# EAGLE schematic untitled (EAGLE 9.1.3)
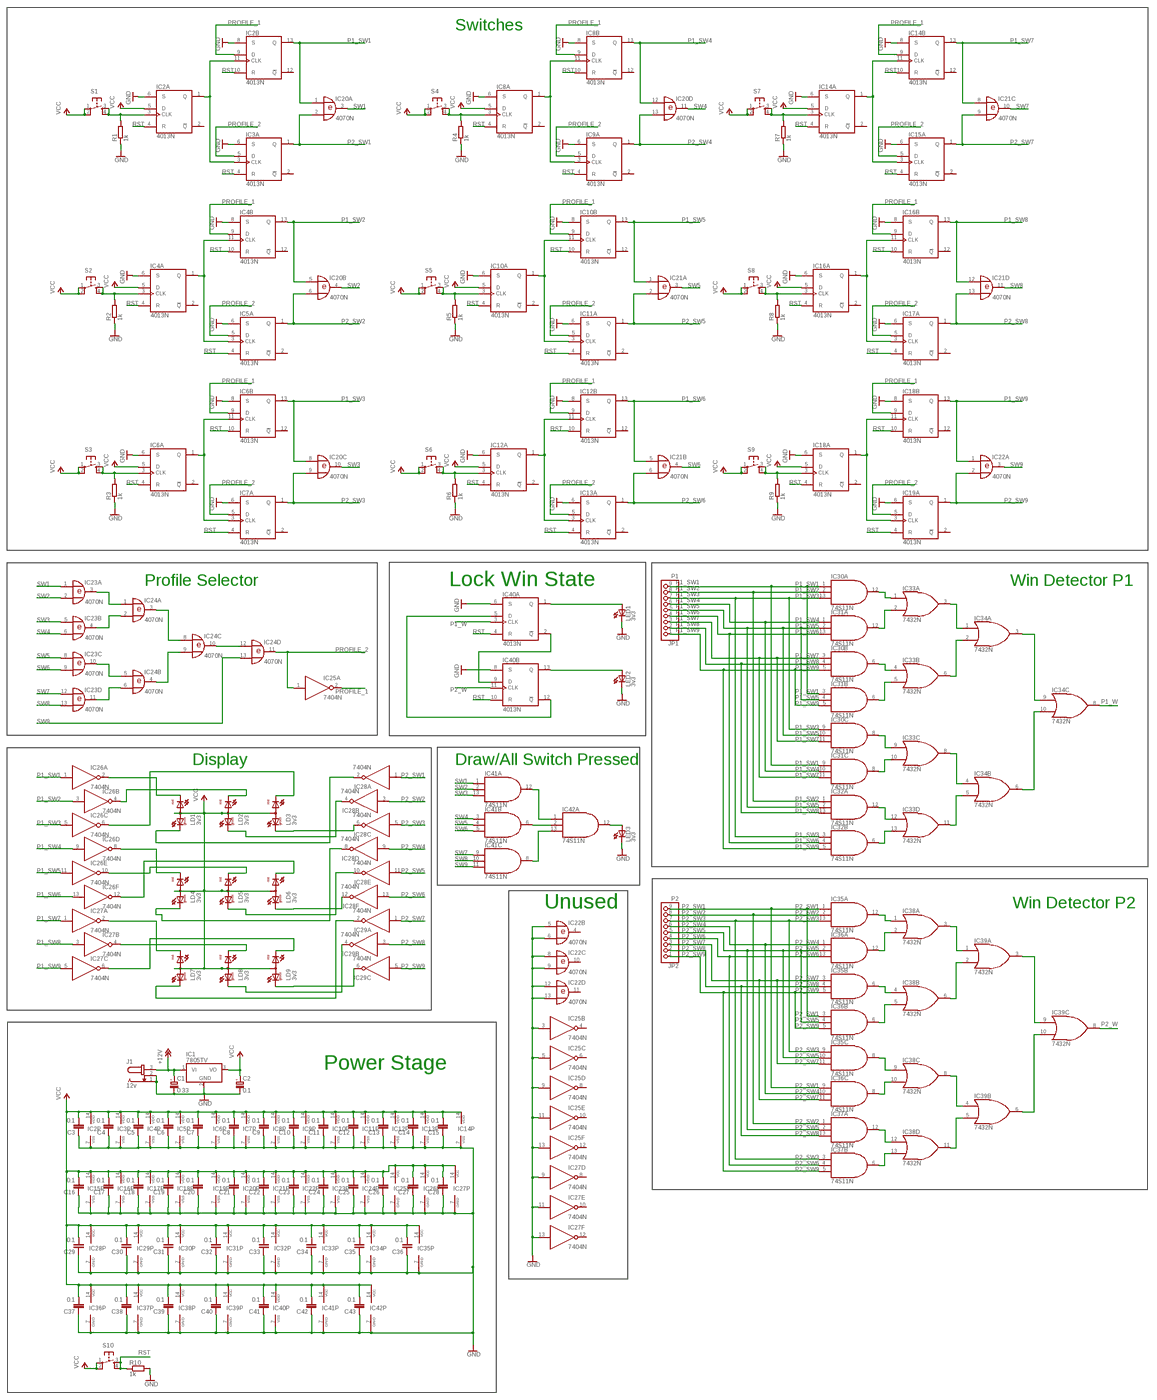
[diagram p0: schematic, sheet 1, overview]
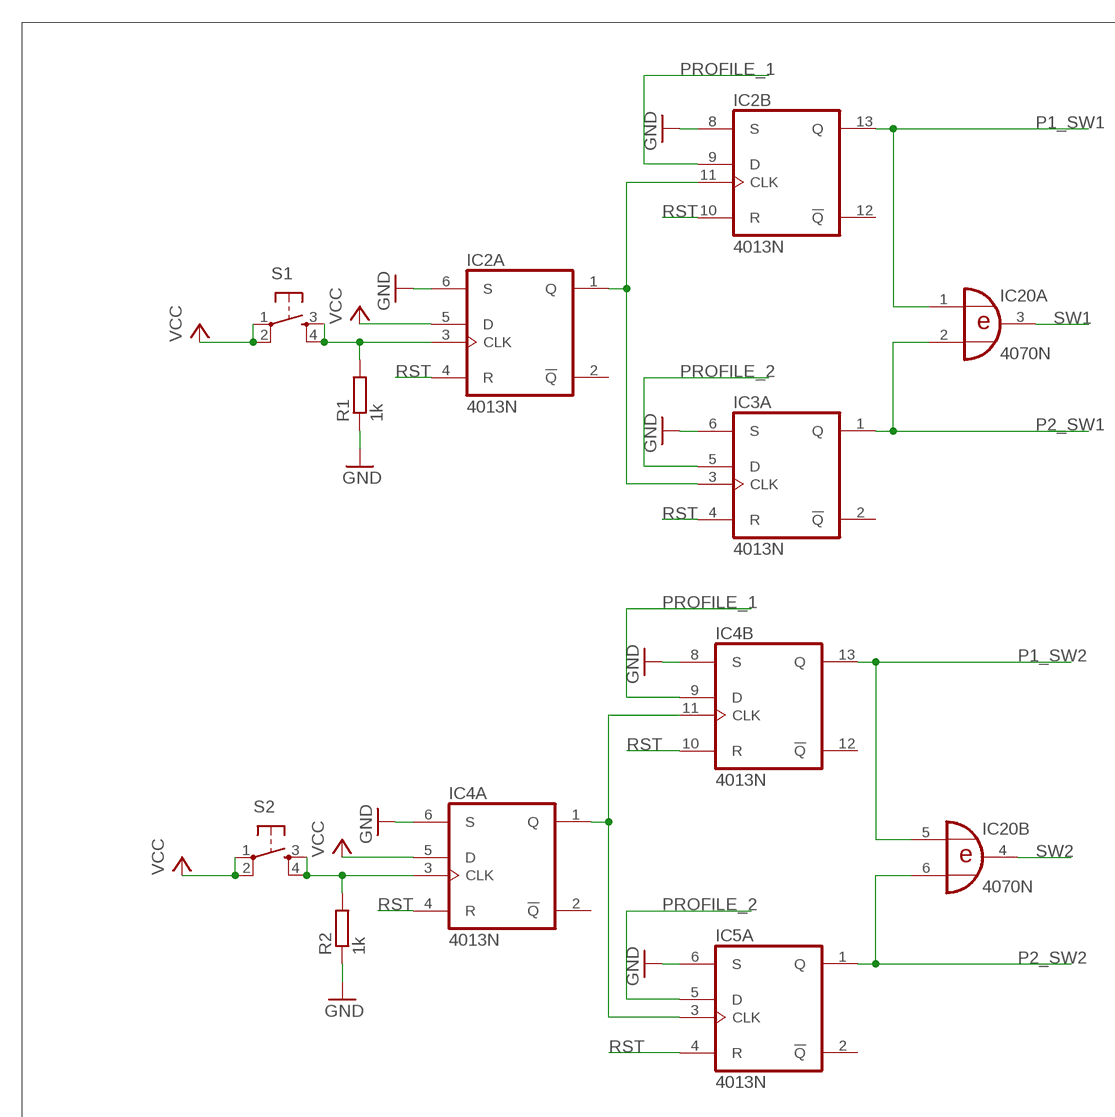
[diagram p1: schematic, sheet 1, part 1 of 4]
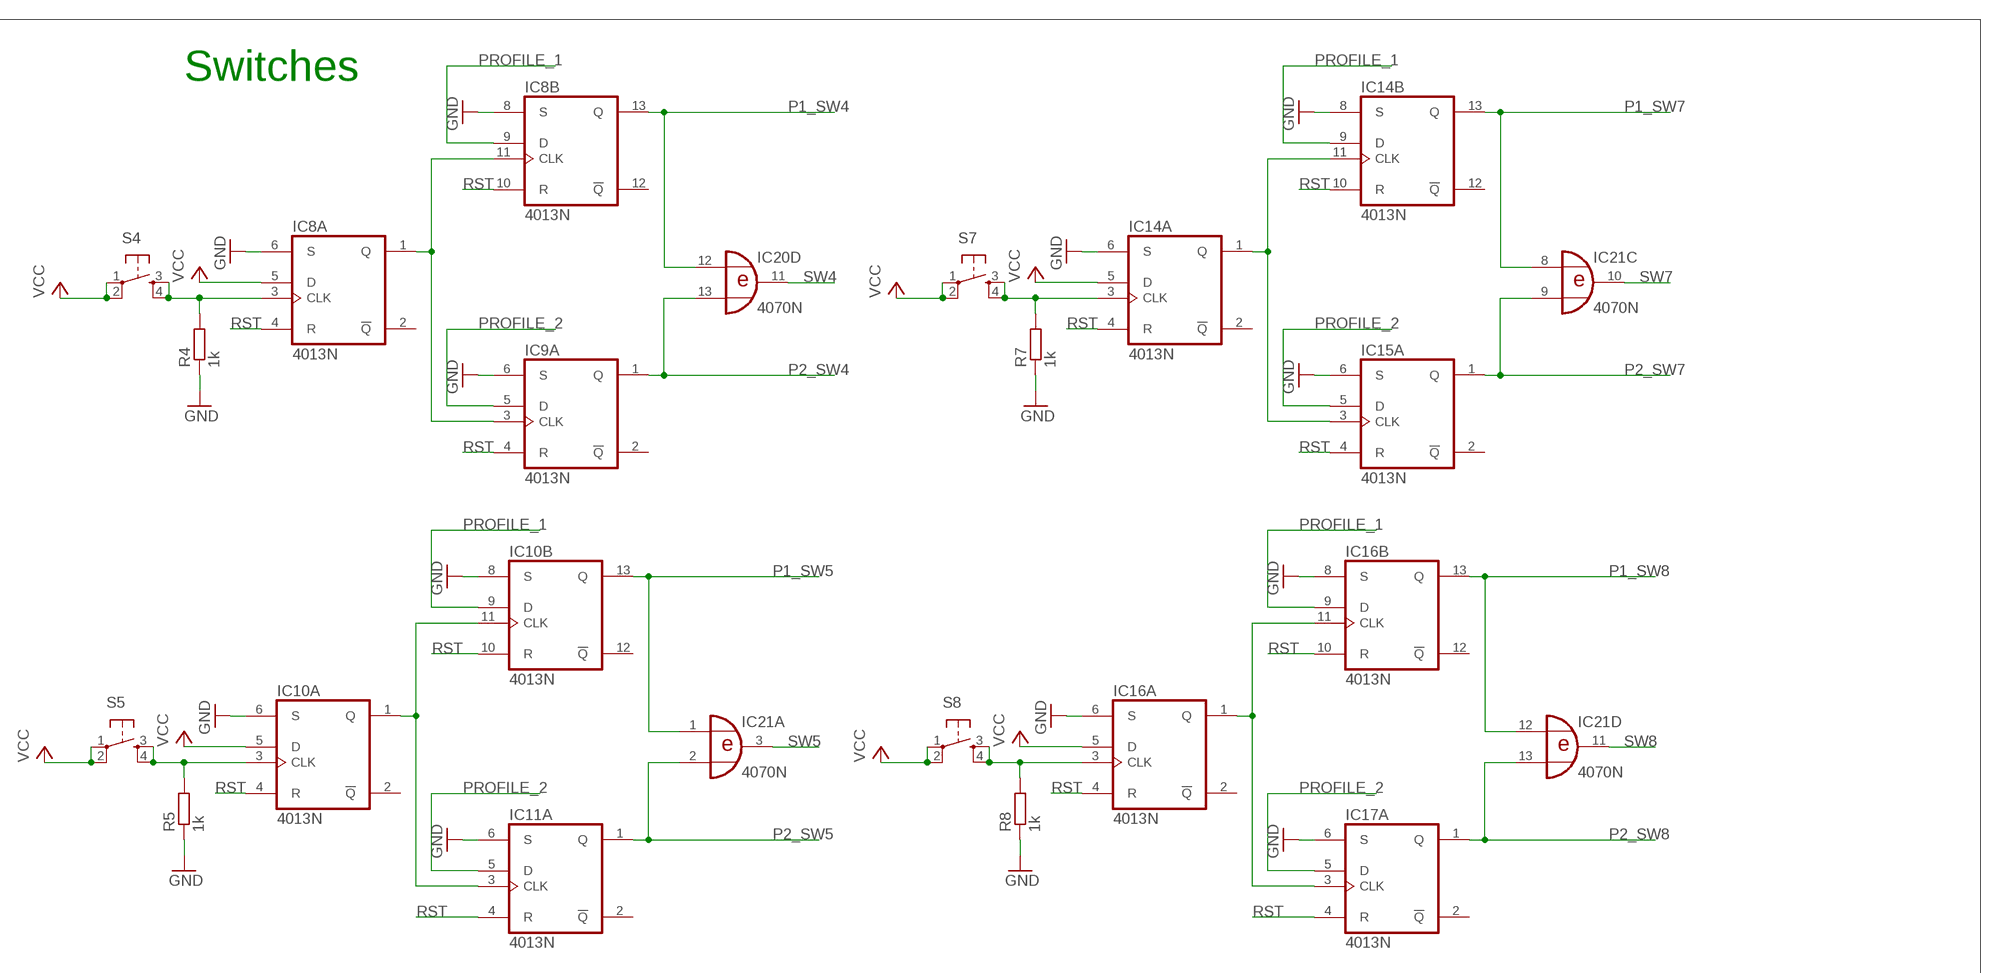
[diagram p2: schematic, sheet 1, part 2 of 4]
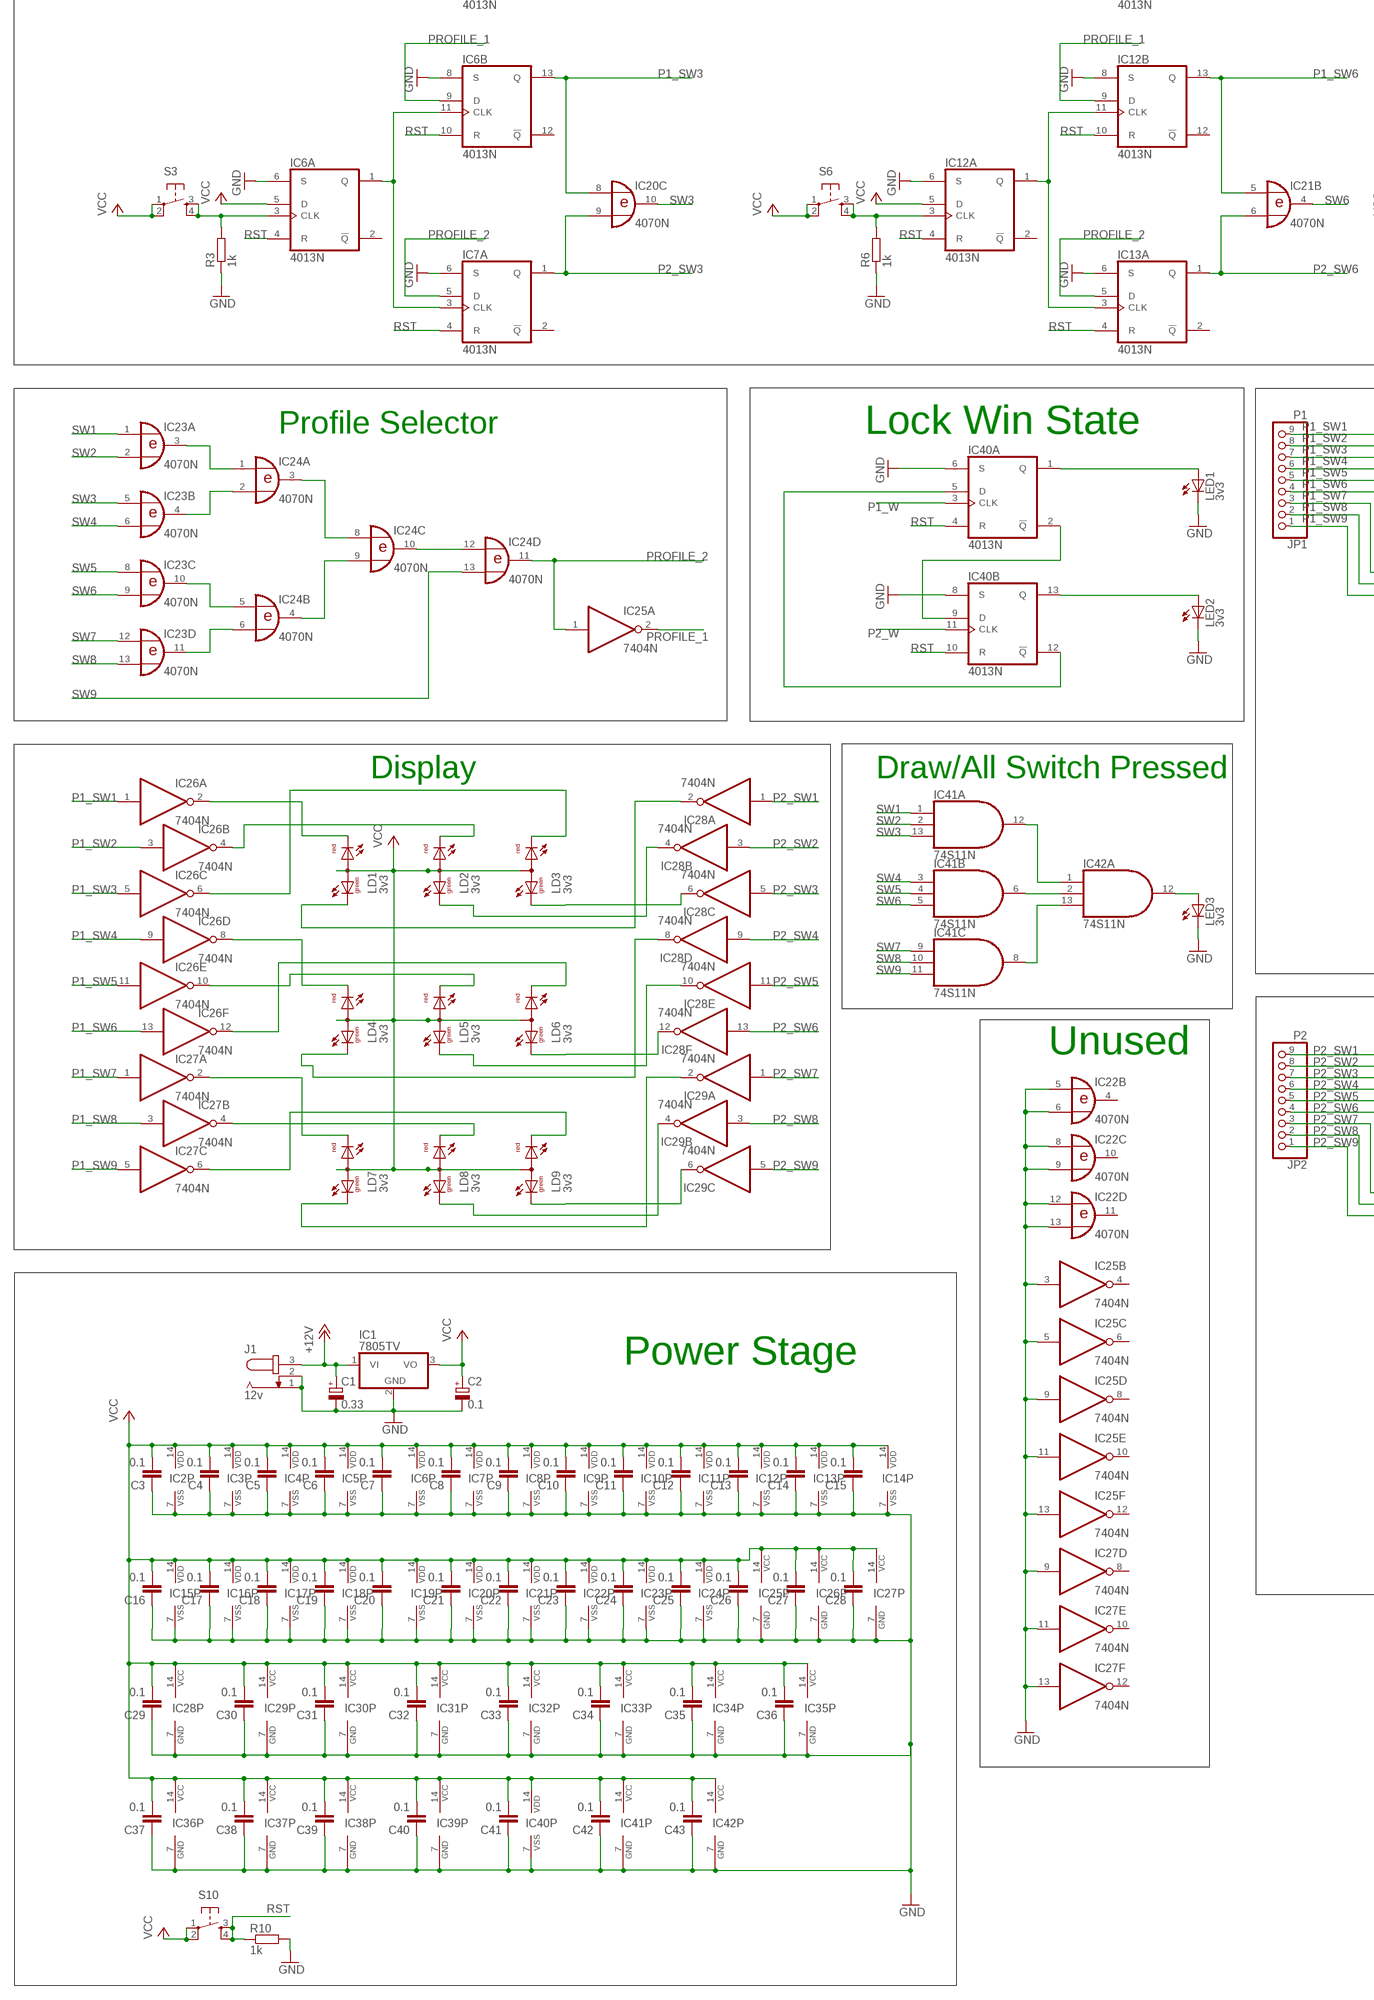
[diagram p3: schematic, sheet 1, part 3 of 4]
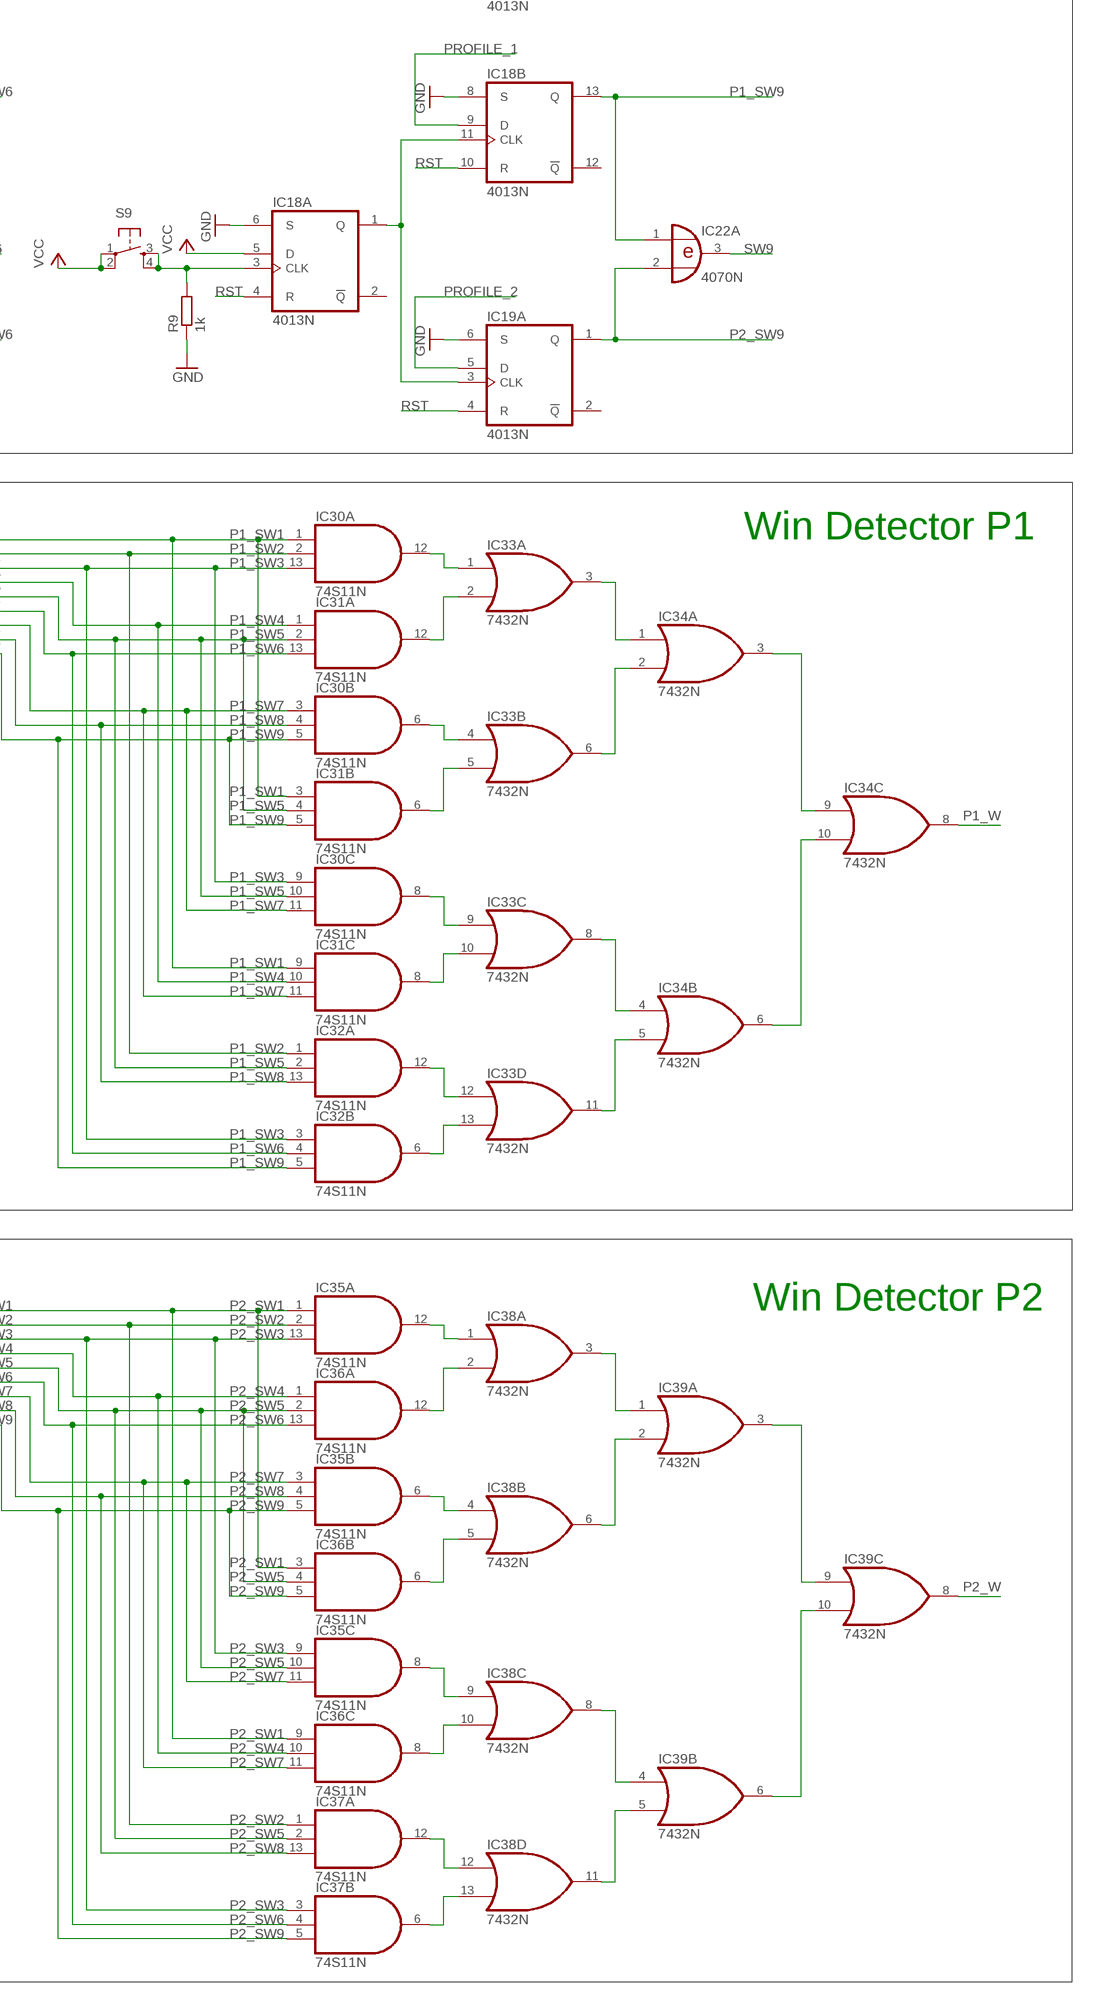
[diagram p4: schematic, sheet 1, part 4 of 4]

## Parts
C1  0.33  CPOL-EUE5-8.5  [E5-8,5]
C2  0.1  CPOL-EUE5-8.5  [E5-8,5]
C3  0.1  C-EU025-050X050  [C025-050X050]
C4  0.1  C-EU025-050X050  [C025-050X050]
C5  0.1  C-EU025-050X050  [C025-050X050]
C6  0.1  C-EU025-050X050  [C025-050X050]
C7  0.1  C-EU025-050X050  [C025-050X050]
C8  0.1  C-EU025-050X050  [C025-050X050]
C9  0.1  C-EU025-050X050  [C025-050X050]
C10  0.1  C-EU025-050X050  [C025-050X050]
C11  0.1  C-EU025-050X050  [C025-050X050]
C12  0.1  C-EU025-050X050  [C025-050X050]
C13  0.1  C-EU025-050X050  [C025-050X050]
C14  0.1  C-EU025-050X050  [C025-050X050]
C15  0.1  C-EU025-050X050  [C025-050X050]
C16  0.1  C-EU025-050X050  [C025-050X050]
C17  0.1  C-EU025-050X050  [C025-050X050]
C18  0.1  C-EU025-050X050  [C025-050X050]
C19  0.1  C-EU025-050X050  [C025-050X050]
C20  0.1  C-EU025-050X050  [C025-050X050]
C21  0.1  C-EU025-050X050  [C025-050X050]
C22  0.1  C-EU025-050X050  [C025-050X050]
C23  0.1  C-EU025-050X050  [C025-050X050]
C24  0.1  C-EU025-050X050  [C025-050X050]
C25  0.1  C-EU025-050X050  [C025-050X050]
C26  0.1  C-EU025-050X050  [C025-050X050]
C27  0.1  C-EU025-050X050  [C025-050X050]
C28  0.1  C-EU025-050X050  [C025-050X050]
C29  0.1  C-EU025-050X050  [C025-050X050]
C30  0.1  C-EU025-050X050  [C025-050X050]
C31  0.1  C-EU025-050X050  [C025-050X050]
C32  0.1  C-EU025-050X050  [C025-050X050]
C33  0.1  C-EU025-050X050  [C025-050X050]
C34  0.1  C-EU025-050X050  [C025-050X050]
C35  0.1  C-EU025-050X050  [C025-050X050]
C36  0.1  C-EU025-050X050  [C025-050X050]
C37  0.1  C-EU025-050X050  [C025-050X050]
C38  0.1  C-EU025-050X050  [C025-050X050]
C39  0.1  C-EU025-050X050  [C025-050X050]
C40  0.1  C-EU025-050X050  [C025-050X050]
C41  0.1  C-EU025-050X050  [C025-050X050]
C42  0.1  C-EU025-050X050  [C025-050X050]
C43  0.1  C-EU025-050X050  [C025-050X050]
IC1  7805TV  [TO220V]
IC2  4013N  [DIL14]
IC3  4013N  [DIL14]
IC4  4013N  [DIL14]
IC5  4013N  [DIL14]
IC6  4013N  [DIL14]
IC7  4013N  [DIL14]
IC8  4013N  [DIL14]
IC9  4013N  [DIL14]
IC10  4013N  [DIL14]
IC11  4013N  [DIL14]
IC12  4013N  [DIL14]
IC13  4013N  [DIL14]
IC14  4013N  [DIL14]
IC15  4013N  [DIL14]
IC16  4013N  [DIL14]
IC17  4013N  [DIL14]
IC18  4013N  [DIL14]
IC19  4013N  [DIL14]
IC20  4070N  [DIL14]
IC21  4070N  [DIL14]
IC22  4070N  [DIL14]
IC23  4070N  [DIL14]
IC24  4070N  [DIL14]
IC25  7404N  [DIL14]
IC26  7404N  [DIL14]
IC27  7404N  [DIL14]
IC28  7404N  [DIL14]
IC29  7404N  [DIL14]
IC30  74S11N  [DIL14]
IC31  74S11N  [DIL14]
IC32  74S11N  [DIL14]
IC33  7432N  [DIL14]
IC34  7432N  [DIL14]
IC35  74S11N  [DIL14]
IC36  74S11N  [DIL14]
IC37  74S11N  [DIL14]
IC38  7432N  [DIL14]
IC39  7432N  [DIL14]
IC40  4013N  [DIL14]
IC41  74S11N  [DIL14]
IC42  74S11N  [DIL14]
J1  12v  JACK-PLUG0  [SPC4077]
JP1  P1  PINHD-1X9/90  [1X09/90]
JP2  P2  PINHD-1X9/90  [1X09/90]
LD1  3v3  DUOLED-RG-A  [DUOLED-A-5MM]
LD2  3v3  DUOLED-RG-A  [DUOLED-A-5MM]
LD3  3v3  DUOLED-RG-A  [DUOLED-A-5MM]
LD4  3v3  DUOLED-RG-A  [DUOLED-A-5MM]
LD5  3v3  DUOLED-RG-A  [DUOLED-A-5MM]
LD6  3v3  DUOLED-RG-A  [DUOLED-A-5MM]
LD7  3v3  DUOLED-RG-A  [DUOLED-A-5MM]
LD8  3v3  DUOLED-RG-A  [DUOLED-A-5MM]
LD9  3v3  DUOLED-RG-A  [DUOLED-A-5MM]
LED1  3v3  LED5MM  [LED5MM]
LED2  3v3  LED5MM  [LED5MM]
LED3  3v3  LED5MM  [LED5MM]
R1  1k  R-EU_0207/7  [0207/7]
R2  1k  R-EU_0207/7  [0207/7]
R3  1k  R-EU_0207/7  [0207/7]
R4  1k  R-EU_0207/7  [0207/7]
R5  1k  R-EU_0207/7  [0207/7]
R6  1k  R-EU_0207/7  [0207/7]
R7  1k  R-EU_0207/7  [0207/7]
R8  1k  R-EU_0207/7  [0207/7]
R9  1k  R-EU_0207/7  [0207/7]
R10  1k  R-EU_0207/7  [0207/7]
S1  TAC_SWITCHPTH  [TACTILE-PTH]
S2  TAC_SWITCHPTH  [TACTILE-PTH]
S3  TAC_SWITCHPTH  [TACTILE-PTH]
S4  TAC_SWITCHPTH  [TACTILE-PTH]
S5  TAC_SWITCHPTH  [TACTILE-PTH]
S6  TAC_SWITCHPTH  [TACTILE-PTH]
S7  TAC_SWITCHPTH  [TACTILE-PTH]
S8  TAC_SWITCHPTH  [TACTILE-PTH]
S9  TAC_SWITCHPTH  [TACTILE-PTH]
S10  TAC_SWITCHPTH  [TACTILE-PTH]

## Nets
+12V: C1.+ IC1.1(VI) J1.3
GND: C1.- C2.- C3.1 C4.1 C5.1 C6.1 C7.1 C8.1 C9.1 C10.1 C11.1 C12.1 C13.1 C14.1 C15.1 C16.1 C17.1 C18.1 C19.1 C20.1 C21.1 C22.1 C23.1 C24.1 C25.1 C26.1 C27.1 C28.1 C29.1 C30.1 C31.1 C32.1 C33.1 C34.1 C35.1 C36.1 C37.1 C38.1 C39.1 C40.1 C41.1 C42.1 C43.1 IC1.2(GND) IC2.6(A:S) IC2.7(P:VSS) IC2.8(B:S) IC3.6(A:S) IC3.7(P:VSS) IC4.6(A:S) IC4.7(P:VSS) IC4.8(B:S) IC5.6(A:S) IC5.7(P:VSS) IC6.6(A:S) IC6.7(P:VSS) IC6.8(B:S) IC7.6(A:S) IC7.7(P:VSS) IC8.6(A:S) IC8.7(P:VSS) IC8.8(B:S) IC9.6(A:S) IC9.7(P:VSS) IC10.6(A:S) IC10.7(P:VSS) IC10.8(B:S) IC11.6(A:S) IC11.7(P:VSS) IC12.6(A:S) IC12.7(P:VSS) IC12.8(B:S) IC13.6(A:S) IC13.7(P:VSS) IC14.6(A:S) IC14.7(P:VSS) IC14.8(B:S) IC15.6(A:S) IC15.7(P:VSS) IC16.6(A:S) IC16.7(P:VSS) IC16.8(B:S) IC17.6(A:S) IC17.7(P:VSS) IC18.6(A:S) IC18.7(P:VSS) IC18.8(B:S) IC19.6(A:S) IC19.7(P:VSS) IC20.7(P:VSS) IC21.7(P:VSS) IC22.5(B:I0) IC22.6(B:I1) IC22.7(P:VSS) IC22.8(C:I0) IC22.9(C:I1) IC22.12(D:I0) IC22.13(D:I1) IC23.7(P:VSS) IC24.7(P:VSS) IC25.3(B:I) IC25.5(C:I) IC25.7(P:GND) IC25.9(D:I) IC25.11(E:I) IC25.13(F:I) IC26.7(P:GND) IC27.7(P:GND) IC27.9(D:I) IC27.11(E:I) IC27.13(F:I) IC28.7(P:GND) IC29.7(P:GND) IC30.7(P:GND) IC31.7(P:GND) IC32.7(P:GND) IC33.7(P:GND) IC34.7(P:GND) IC35.7(P:GND) IC36.7(P:GND) IC37.7(P:GND) IC38.7(P:GND) IC39.7(P:GND) IC40.6(A:S) IC40.7(P:VSS) IC40.8(B:S) IC41.7(P:GND) IC42.7(P:GND) J1.1 J1.2 LED1.K(C) LED2.K(C) LED3.K(C) R1.1 R2.1 R3.1 R4.1 R5.1 R6.1 R7.1 R8.1 R9.1 R10.2
N$1: IC2.3(A:CLK) R1.2 S1.3 S1.4
N$2: IC2.1(A:Q) IC2.11(B:CLK) IC3.3(A:CLK)
N$3: IC4.3(A:CLK) R2.2 S2.3 S2.4
N$4: IC4.1(A:Q) IC4.11(B:CLK) IC5.3(A:CLK)
N$5: IC6.3(A:CLK) R3.2 S3.3 S3.4
N$6: IC6.1(A:Q) IC6.11(B:CLK) IC7.3(A:CLK)
N$7: IC8.3(A:CLK) R4.2 S4.3 S4.4
N$8: IC8.1(A:Q) IC8.11(B:CLK) IC9.3(A:CLK)
N$9: IC10.3(A:CLK) R5.2 S5.3 S5.4
N$10: IC10.1(A:Q) IC10.11(B:CLK) IC11.3(A:CLK)
N$11: IC12.3(A:CLK) R6.2 S6.3 S6.4
N$12: IC12.1(A:Q) IC12.11(B:CLK) IC13.3(A:CLK)
N$13: IC14.3(A:CLK) R7.2 S7.3 S7.4
N$14: IC14.1(A:Q) IC14.11(B:CLK) IC15.3(A:CLK)
N$15: IC16.3(A:CLK) R8.2 S8.3 S8.4
N$16: IC16.1(A:Q) IC16.11(B:CLK) IC17.3(A:CLK)
N$17: IC18.3(A:CLK) R9.2 S9.3 S9.4
N$18: IC18.1(A:Q) IC18.11(B:CLK) IC19.3(A:CLK)
N$20: IC23.3(A:O) IC24.1(A:I0)
N$21: IC23.4(B:O) IC24.2(A:I1)
N$22: IC23.10(C:O) IC24.5(B:I0)
N$23: IC23.11(D:O) IC24.6(B:I1)
N$24: IC24.3(A:O) IC24.8(C:I0)
N$25: IC24.4(B:O) IC24.9(C:I1)
N$26: IC24.10(C:O) IC24.12(D:I0)
N$28: IC30.12(A:O) IC33.1(A:I0)
N$29: IC31.12(A:O) IC33.2(A:I1)
N$30: IC27.2(A:O) LD7.CR
N$31: IC26.2(A:O) LD1.CR
N$32: IC26.8(D:O) LD4.CR
N$33: IC30.6(B:O) IC33.4(B:I0)
N$34: IC29.2(A:O) LD7.CX(CG)
N$35: IC28.8(D:O) LD4.CX(CG)
N$36: IC28.2(A:O) LD1.CX(CG)
N$37: IC26.4(B:O) LD2.CR
N$38: IC28.4(B:O) LD2.CX(CG)
N$39: IC26.10(E:O) LD5.CR
N$40: IC28.10(E:O) LD5.CX(CG)
N$41: IC27.4(B:O) LD8.CR
N$42: IC29.4(B:O) LD8.CX(CG)
N$43: IC26.6(C:O) LD3.CR
N$44: IC28.6(C:O) LD3.CX(CG)
N$45: IC26.12(F:O) LD6.CR
N$46: IC28.12(F:O) LD6.CX(CG)
N$47: IC27.6(C:O) LD9.CR
N$48: IC29.6(C:O) LD9.CX(CG)
N$49: IC31.6(B:O) IC33.5(B:I1)
N$50: IC33.3(A:O) IC34.1(A:I0)
N$51: IC33.6(B:O) IC34.2(A:I1)
N$52: IC30.8(C:O) IC33.9(C:I0)
N$53: IC31.8(C:O) IC33.10(C:I1)
N$54: IC40.1(A:Q) LED1.A
N$55: IC40.13(B:Q) LED2.A
N$56: IC40.2(A:!Q) IC40.9(B:D)
N$59: IC41.6(B:O) IC42.2(A:I1)
N$60: IC41.8(C:O) IC42.13(A:I2)
N$61: IC40.5(A:D) IC40.12(B:!Q)
N$62: IC41.12(A:O) IC42.1(A:I0)
N$64: IC32.12(A:O) IC33.12(D:I0)
N$65: IC32.6(B:O) IC33.13(D:I1)
N$66: IC33.8(C:O) IC34.4(B:I0)
N$67: IC33.11(D:O) IC34.5(B:I1)
N$68: IC34.3(A:O) IC34.9(C:I0)
N$69: IC34.6(B:O) IC34.10(C:I1)
N$72: IC35.12(A:O) IC38.1(A:I0)
N$73: IC36.12(A:O) IC38.2(A:I1)
N$74: IC35.6(B:O) IC38.4(B:I0)
N$75: IC36.6(B:O) IC38.5(B:I1)
N$76: IC38.3(A:O) IC39.1(A:I0)
N$77: IC38.6(B:O) IC39.2(A:I1)
N$87: IC35.8(C:O) IC38.9(C:I0)
N$88: IC36.8(C:O) IC38.10(C:I1)
N$89: IC37.12(A:O) IC38.12(D:I0)
N$90: IC37.6(B:O) IC38.13(D:I1)
N$91: IC38.8(C:O) IC39.4(B:I0)
N$92: IC38.11(D:O) IC39.5(B:I1)
N$93: IC39.3(A:O) IC39.9(C:I0)
N$94: IC39.6(B:O) IC39.10(C:I1)
N$130: IC42.12(A:O) LED3.A
P1_SW1: IC2.13(B:Q) IC20.1(A:I0) IC26.1(A:I) IC30.1(A:I0) IC31.3(B:I0) IC31.9(C:I0) JP1.9
P1_SW2: IC4.13(B:Q) IC20.5(B:I0) IC26.3(B:I) IC30.2(A:I1) IC32.1(A:I0) JP1.8
P1_SW3: IC6.13(B:Q) IC20.8(C:I0) IC26.5(C:I) IC30.9(C:I0) IC30.13(A:I2) IC32.3(B:I0) JP1.7
P1_SW4: IC8.13(B:Q) IC20.12(D:I0) IC26.9(D:I) IC31.1(A:I0) IC31.10(C:I1) JP1.6
P1_SW5: IC10.13(B:Q) IC21.1(A:I0) IC26.11(E:I) IC30.10(C:I1) IC31.2(A:I1) IC31.4(B:I1) IC32.2(A:I1) JP1.5
P1_SW6: IC12.13(B:Q) IC21.5(B:I0) IC26.13(F:I) IC31.13(A:I2) IC32.4(B:I1) JP1.4
P1_SW7: IC14.13(B:Q) IC21.8(C:I0) IC27.1(A:I) IC30.3(B:I0) IC30.11(C:I2) IC31.11(C:I2) JP1.3
P1_SW8: IC16.13(B:Q) IC21.12(D:I0) IC27.3(B:I) IC30.4(B:I1) IC32.13(A:I2) JP1.2
P1_SW9: IC18.13(B:Q) IC22.1(A:I0) IC27.5(C:I) IC30.5(B:I2) IC31.5(B:I2) IC32.5(B:I2) JP1.1
P1_W: IC34.8(C:O) IC40.3(A:CLK)
P2_SW1: IC3.1(A:Q) IC20.2(A:I1) IC28.1(A:I) IC35.1(A:I0) IC36.3(B:I0) IC36.9(C:I0) JP2.9
P2_SW2: IC5.1(A:Q) IC20.6(B:I1) IC28.3(B:I) IC35.2(A:I1) IC37.1(A:I0) JP2.8
P2_SW3: IC7.1(A:Q) IC20.9(C:I1) IC28.5(C:I) IC35.9(C:I0) IC35.13(A:I2) IC37.3(B:I0) JP2.7
P2_SW4: IC9.1(A:Q) IC20.13(D:I1) IC28.9(D:I) IC36.1(A:I0) IC36.10(C:I1) JP2.6
P2_SW5: IC11.1(A:Q) IC21.2(A:I1) IC28.11(E:I) IC35.10(C:I1) IC36.2(A:I1) IC36.4(B:I1) IC37.2(A:I1) JP2.5
P2_SW6: IC13.1(A:Q) IC21.6(B:I1) IC28.13(F:I) IC36.13(A:I2) IC37.4(B:I1) JP2.4
P2_SW7: IC15.1(A:Q) IC21.9(C:I1) IC29.1(A:I) IC35.3(B:I0) IC35.11(C:I2) IC36.11(C:I2) JP2.3
P2_SW8: IC17.1(A:Q) IC21.13(D:I1) IC29.3(B:I) IC35.4(B:I1) IC37.13(A:I2) JP2.2
P2_SW9: IC19.1(A:Q) IC22.2(A:I1) IC29.5(C:I) IC35.5(B:I2) IC36.5(B:I2) IC37.5(B:I2) JP2.1
P2_W: IC39.8(C:O) IC40.11(B:CLK)
PROFILE_1: IC2.9(B:D) IC4.9(B:D) IC6.9(B:D) IC8.9(B:D) IC10.9(B:D) IC12.9(B:D) IC14.9(B:D) IC16.9(B:D) IC18.9(B:D) IC25.2(A:O)
PROFILE_2: IC3.5(A:D) IC5.5(A:D) IC7.5(A:D) IC9.5(A:D) IC11.5(A:D) IC13.5(A:D) IC15.5(A:D) IC17.5(A:D) IC19.5(A:D) IC24.11(D:O) IC25.1(A:I)
RST: IC2.4(A:R) IC2.10(B:R) IC3.4(A:R) IC4.4(A:R) IC4.10(B:R) IC5.4(A:R) IC6.4(A:R) IC6.10(B:R) IC7.4(A:R) IC8.4(A:R) IC8.10(B:R) IC9.4(A:R) IC10.4(A:R) IC10.10(B:R) IC11.4(A:R) IC12.4(A:R) IC12.10(B:R) IC13.4(A:R) IC14.4(A:R) IC14.10(B:R) IC15.4(A:R) IC16.4(A:R) IC16.10(B:R) IC17.4(A:R) IC18.4(A:R) IC18.10(B:R) IC19.4(A:R) IC40.4(A:R) IC40.10(B:R) R10.1 S10.3 S10.4
SW1: IC20.3(A:O) IC23.1(A:I0) IC41.1(A:I0)
SW2: IC20.4(B:O) IC23.2(A:I1) IC41.2(A:I1)
SW3: IC20.10(C:O) IC23.5(B:I0) IC41.13(A:I2)
SW4: IC20.11(D:O) IC23.6(B:I1) IC41.3(B:I0)
SW5: IC21.3(A:O) IC23.8(C:I0) IC41.4(B:I1)
SW6: IC21.4(B:O) IC23.9(C:I1) IC41.5(B:I2)
SW7: IC21.10(C:O) IC23.12(D:I0) IC41.9(C:I0)
SW8: IC21.11(D:O) IC23.13(D:I1) IC41.10(C:I1)
SW9: IC22.3(A:O) IC24.13(D:I1) IC41.11(C:I2)
VCC: C2.+ C3.2 C4.2 C5.2 C6.2 C7.2 C8.2 C9.2 C10.2 C11.2 C12.2 C13.2 C14.2 C15.2 C16.2 C17.2 C18.2 C19.2 C20.2 C21.2 C22.2 C23.2 C24.2 C25.2 C26.2 C27.2 C28.2 C29.2 C30.2 C31.2 C32.2 C33.2 C34.2 C35.2 C36.2 C37.2 C38.2 C39.2 C40.2 C41.2 C42.2 C43.2 IC1.3(VO) IC2.5(A:D) IC2.14(P:VDD) IC3.14(P:VDD) IC4.5(A:D) IC4.14(P:VDD) IC5.14(P:VDD) IC6.5(A:D) IC6.14(P:VDD) IC7.14(P:VDD) IC8.5(A:D) IC8.14(P:VDD) IC9.14(P:VDD) IC10.5(A:D) IC10.14(P:VDD) IC11.14(P:VDD) IC12.5(A:D) IC12.14(P:VDD) IC13.14(P:VDD) IC14.5(A:D) IC14.14(P:VDD) IC15.14(P:VDD) IC16.5(A:D) IC16.14(P:VDD) IC17.14(P:VDD) IC18.5(A:D) IC18.14(P:VDD) IC19.14(P:VDD) IC20.14(P:VDD) IC21.14(P:VDD) IC22.14(P:VDD) IC23.14(P:VDD) IC24.14(P:VDD) IC25.14(P:VCC) IC26.14(P:VCC) IC27.14(P:VCC) IC28.14(P:VCC) IC29.14(P:VCC) IC30.14(P:VCC) IC31.14(P:VCC) IC32.14(P:VCC) IC33.14(P:VCC) IC34.14(P:VCC) IC35.14(P:VCC) IC36.14(P:VCC) IC37.14(P:VCC) IC38.14(P:VCC) IC39.14(P:VCC) IC40.14(P:VDD) IC41.14(P:VCC) IC42.14(P:VCC) LD1.A LD2.A LD3.A LD4.A LD5.A LD6.A LD7.A LD8.A LD9.A S1.1 S1.2 S2.1 S2.2 S3.1 S3.2 S4.1 S4.2 S5.1 S5.2 S6.1 S6.2 S7.1 S7.2 S8.1 S8.2 S9.1 S9.2 S10.1 S10.2
Unconnected: IC2.2(A:!Q) IC2.12(B:!Q) IC3.2(A:!Q) IC3.8(B:S) IC3.9(B:D) IC3.10(B:R) IC3.11(B:CLK) IC3.12(B:!Q) IC3.13(B:Q) IC4.2(A:!Q) IC4.12(B:!Q) IC5.2(A:!Q) IC5.8(B:S) IC5.9(B:D) IC5.10(B:R) IC5.11(B:CLK) IC5.12(B:!Q) IC5.13(B:Q) IC6.2(A:!Q) IC6.12(B:!Q) IC7.2(A:!Q) IC7.8(B:S) IC7.9(B:D) IC7.10(B:R) IC7.11(B:CLK) IC7.12(B:!Q) IC7.13(B:Q) IC8.2(A:!Q) IC8.12(B:!Q) IC9.2(A:!Q) IC9.8(B:S) IC9.9(B:D) IC9.10(B:R) IC9.11(B:CLK) IC9.12(B:!Q) IC9.13(B:Q) IC10.2(A:!Q) IC10.12(B:!Q) IC11.2(A:!Q) IC11.8(B:S) IC11.9(B:D) IC11.10(B:R) IC11.11(B:CLK) IC11.12(B:!Q) IC11.13(B:Q) IC12.2(A:!Q) IC12.12(B:!Q) IC13.2(A:!Q) IC13.8(B:S) IC13.9(B:D) IC13.10(B:R) IC13.11(B:CLK) IC13.12(B:!Q) IC13.13(B:Q) IC14.2(A:!Q) IC14.12(B:!Q) IC15.2(A:!Q) IC15.8(B:S) IC15.9(B:D) IC15.10(B:R) IC15.11(B:CLK) IC15.12(B:!Q) IC15.13(B:Q) IC16.2(A:!Q) IC16.12(B:!Q) IC17.2(A:!Q) IC17.8(B:S) IC17.9(B:D) IC17.10(B:R) IC17.11(B:CLK) IC17.12(B:!Q) IC17.13(B:Q) IC18.2(A:!Q) IC18.12(B:!Q) IC19.2(A:!Q) IC19.8(B:S) IC19.9(B:D) IC19.10(B:R) IC19.11(B:CLK) IC19.12(B:!Q) IC19.13(B:Q) IC22.4(B:O) IC22.10(C:O) IC22.11(D:O) IC25.4(B:O) IC25.6(C:O) IC25.8(D:O) IC25.10(E:O) IC25.12(F:O) IC27.8(D:O) IC27.10(E:O) IC27.12(F:O) IC29.8(D:O) IC29.9(D:I) IC29.10(E:O) IC29.11(E:I) IC29.12(F:O) IC29.13(F:I) IC32.8(C:O) IC32.9(C:I0) IC32.10(C:I1) IC32.11(C:I2) IC34.11(D:O) IC34.12(D:I0) IC34.13(D:I1) IC37.8(C:O) IC37.9(C:I0) IC37.10(C:I1) IC37.11(C:I2) IC39.11(D:O) IC39.12(D:I0) IC39.13(D:I1) IC42.3(B:I0) IC42.4(B:I1) IC42.5(B:I2) IC42.6(B:O) IC42.8(C:O) IC42.9(C:I0) IC42.10(C:I1) IC42.11(C:I2)

## Notes on the sheet
- Switches
- Profile Selector | Lock Win State | Win Detector P1
- Display | Draw/All Switch Pressed
- Win Detector P2
- Unused
- Power Stage

## Library data of the parts
C1 C2 = rcl:CPOL-EU: POLARIZED CAPACITOR, European symbol; SPICEPREFIX: C
C3-C43 = rcl:C-EU: CAPACITOR, European symbol; SPICEPREFIX: C
IC1 = linear:78*: Positive VOLTAGE REGULATOR Source: http://cache.national.com/ds/LM/LM78L05.pdf http://www.fairchildsemi.com/ds/LM/LM7805.pdf
IC2-IC19 IC40 = 40xx:4013: Dual D FLIP FLOP, set/reset
IC20-IC24 = 40xx:4070: Quad 2-input XOR
IC25-IC29 = 74xx-us:74*04: Hex INVERTER
IC30-IC32 IC35-IC37 IC41 IC42 = 74xx-us:74*11: Triple 3-input AND gate
IC33 IC34 IC38 IC39 = 74xx-us:74*32: Quad 2-input OR gate
J1 = con-jack:JACK-PLUG: DC POWER JACK Power Jack, DC, Right Angle, Through Hole, Rated 5A at 16VDC, PC Terminals Distributor: Farnell (www.Farnell.de) Drawing: 84N1161.pdf / 84N1162.pdf Manufacturer: SPC Technology (www.spctechnology.com) Type: SPC4077 / SPC 4078; OC_FARNELL: unknown; OC_NEWARK: unknown
JP1 JP2 = pinhead:PINHD-1X9: PIN HEADER
LD1-LD9 = led:DUOLED-RG-A: DUO LED 2 colors (red/green), 5 mm, round, common Anode www.ligitek.com or other producers.
LED1-LED3 = led:LED: LED OSRAM: - CHIPLED LG R971, LG N971, LY N971, LG Q971, LY Q971, LO R971, LY R971 LH N974, LH R974 LS Q976, LO Q976, LY Q976 LO Q996 - Hyper CHIPLED LW Q18S LB Q993, LB Q99A, LB R99A - SideLED LS A670, LO A670, LY A670, LG A670, LP A670 LB A673, LV A673, LT A673, LW A673 LH A674 LY A675 LS A676, LA A676, LO A676, LY A676, LW A676 LS A679, LY A679, LG A679 - Hyper Micro SIDELED® LS Y876, LA Y876, LO Y876, LY Y876 LT Y87S - SmartLED LW L88C, LW L88S LB L89C, LB L89S, LG L890 LS L89K, LO L89K, LY L89K LS L896, LA L896, LO L896, LY L896 - TOPLED LS T670, LO T670, LY T670, LG T670, LP T670 LSG T670, LSP T670, LSY T670, LOP T670, LYG T670 LG T671, LOG T671, LSG T671 LB T673, LV T673, LT T673, LW T673 LH T674 LS T676, LA T676, LO T676, LY T676, LB T676, LH T676, LSB T676, LW T676 LB T67C, LV T67C, LT T67C, LS T67K, LO T67K, LY T67K, LW E67C LS E67B, LA E67B, LO E67B, LY E67B, LB E67C, LV E67C, LT E67C LW T67C LS T679, LY T679, LG T679 LS T770, LO T770, LY T770, LG T770, LP T770 LB T773, LV T773, LT T773, LW T773 LH T774 LS E675, LA E675, LY E675, LS T675 LS T776, LA T776, LO T776, LY T776, LB T776 LHGB T686 LT T68C, LB T68C - Hyper Mini TOPLED® LB M676 - Mini TOPLED Santana® LG M470 LS M47K, LO M47K, LY M47K Source: http://www.osram.convergy.de LUXEON: - LUMILED® LXK2-PW12-R00, LXK2-PW12-S00, LXK2-PW14-U00, LXK2-PW14-V00 LXK2-PM12-R00, LXK2-PM12-S00, LXK2-PM14-U00 LXK2-PE12-Q00, LXK2-PE12-R00, LXK2-PE12-S00, LXK2-PE14-T00, LXK2-PE14-U00 LXK2-PB12-K00, LXK2-PB12-L00, LXK2-PB12-M00, LXK2-PB14-N00, LXK2-PB14-P00, LXK2-PB14-Q00 LXK2-PR12-L00, LXK2-PR12-M00, LXK2-PR14-Q00, LXK2-PR14-R00 LXK2-PD12-Q00, LXK2-PD12-R00, LXK2-PD12-S00 LXK2-PH12-R00, LXK2-PH12-S00 LXK2-PL12-P00, LXK2-PL12-Q00, LXK2-PL12-R00 Source: www.luxeon.com KINGBRIGHT: KA-3528ASYC Source: www.kingbright.com
R1-R10 = rcl:R-EU_: RESISTOR, European symbol; SPICEPREFIX: R
S1-S10 = SparkFun-Retired:TAC_SWITCH: Momentary Switch Button commonly used for reset or general input. Spark Fun Electronics SKU : COM-00097 SMT- SWCH-08247